# Altium schematic sheet Equivalent Inductance 3V3.SchDoc
size A; SheetNumber: 2; SheetTotal: 3
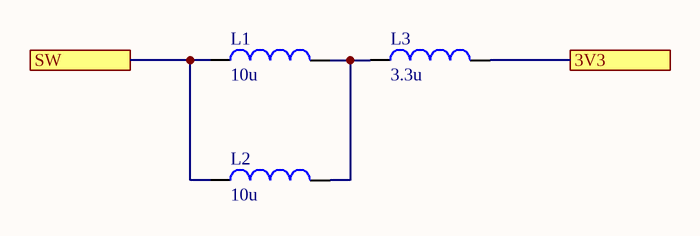
[diagram p0: Equivalent Inductance 3V3.SchDoc]

## Parts
L1  value 10u  (hidden comment: Inductor)
L2  value 10u  (hidden comment: Inductor)
L3  value 3.3u  (hidden comment: Inductor)

## Ports
3V3, SW

## Nets
3V3: L3.2 ; port 3V3
SW: L1.1 L2.1 ; port SW
NetL1_2: L1.2 L2.2 L3.1

## Library data of the parts
L1-L3 = Inductor: SimulationGenericComponent: True